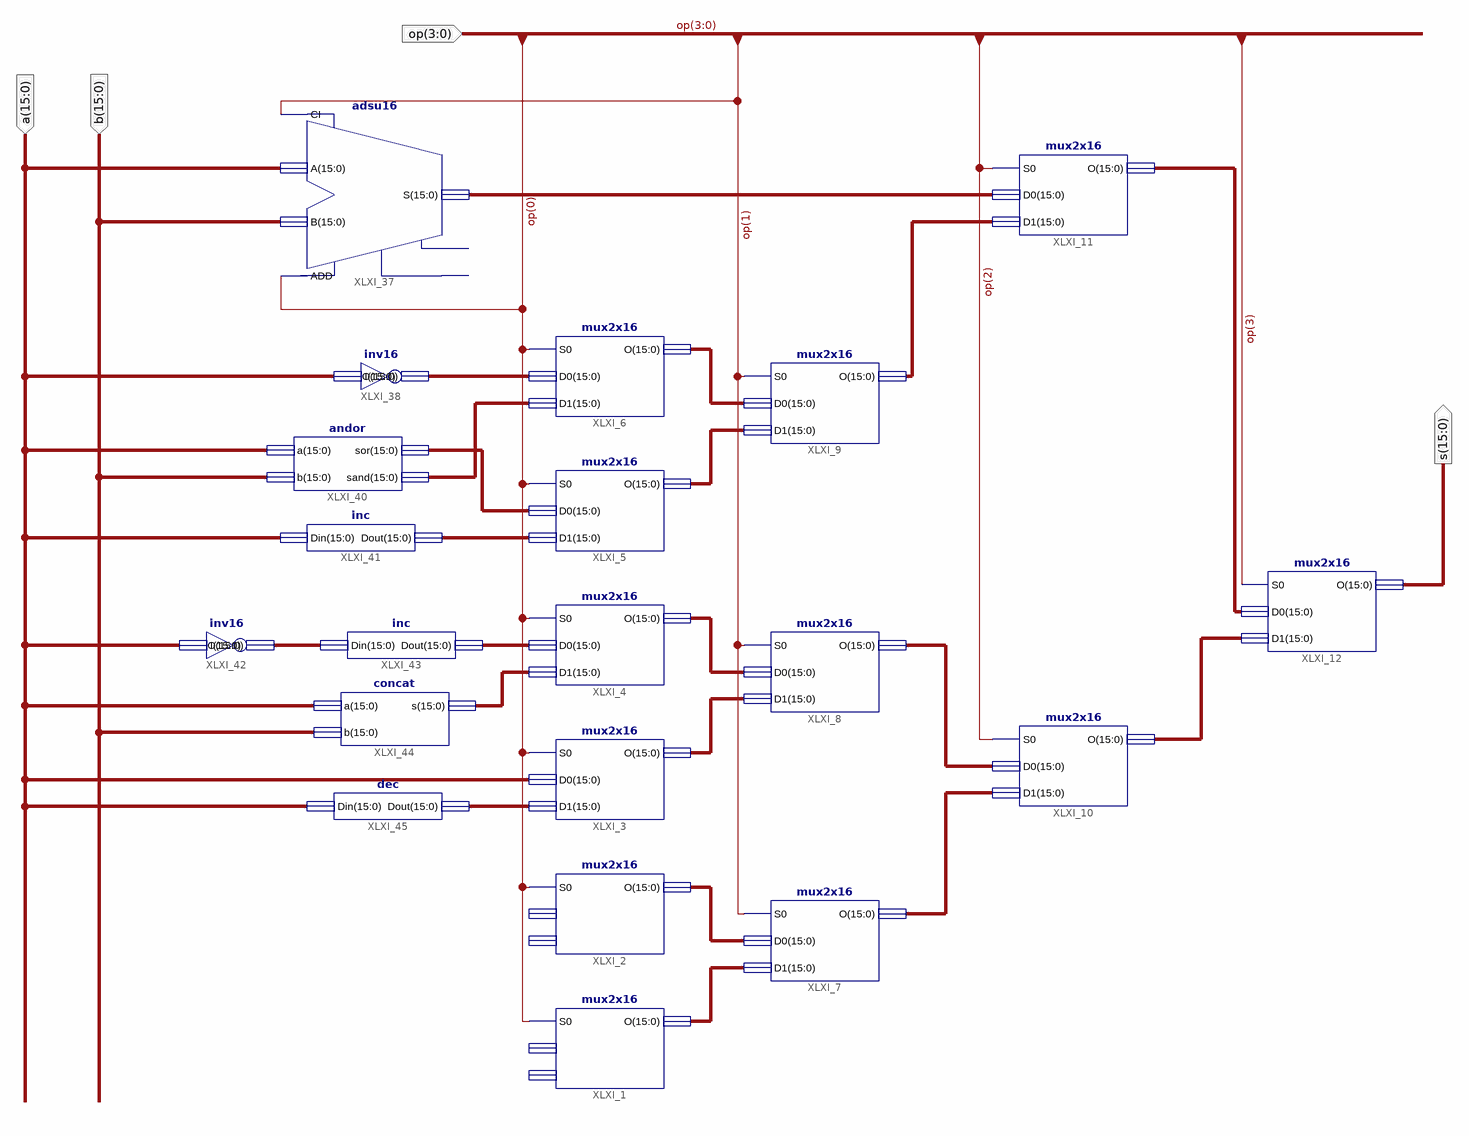
[diagram p0: schematic sheet 1]
// Xilinx ISE schematic ALU.sch (spartan3e) as structural Verilog: 20 symbols, 4 ports
module ALU (
  input  [15:0] a,
  input  [15:0] b,
  input  [3:0] op,
  output [15:0] s
);

  wire [15:0] XLXN_5, XLXN_6, XLXN_7, XLXN_8, XLXN_9, XLXN_10, XLXN_25, XLXN_26, XLXN_33, XLXN_36, XLXN_39,
       XLXN_109, XLXN_110, XLXN_111, XLXN_112, XLXN_113, XLXN_114, XLXN_115, XLXN_116, XLXN_117;

  mux2x16 XLXI_12 (.S0(op[3]), .D0(XLXN_39), .D1(XLXN_36), .O(s));
  mux2x16 XLXI_11 (.S0(op[2]), .D0(XLXN_109), .D1(XLXN_33), .O(XLXN_39));
  mux2x16 XLXI_10 (.S0(op[2]), .D0(XLXN_25), .D1(XLXN_26), .O(XLXN_36));
  mux2x16 XLXI_9 (.S0(op[1]), .D0(XLXN_5), .D1(XLXN_6), .O(XLXN_33));
  mux2x16 XLXI_8 (.S0(op[1]), .D0(XLXN_7), .D1(XLXN_8), .O(XLXN_25));
  mux2x16 XLXI_7 (.S0(op[1]), .D0(XLXN_9), .D1(XLXN_10), .O(XLXN_26));
  mux2x16 XLXI_6 (.S0(op[0]), .D0(XLXN_110), .D1(XLXN_111), .O(XLXN_5));
  mux2x16 XLXI_5 (.S0(op[0]), .D0(XLXN_112), .D1(XLXN_113), .O(XLXN_6));
  mux2x16 XLXI_4 (.S0(op[0]), .D0(XLXN_114), .D1(XLXN_116), .O(XLXN_7));
  mux2x16 XLXI_3 (.S0(op[0]), .D0(a), .D1(XLXN_117), .O(XLXN_8));
  mux2x16 XLXI_2 (.S0(op[0]), .O(XLXN_9));  // open: D0, D1
  mux2x16 XLXI_1 (.S0(op[0]), .O(XLXN_10));  // open: D0, D1
  adsu16 XLXI_37 (.A(a), .ADD(op[0]), .B(b), .CI(op[1]), .S(XLXN_109));  // open: CO, OFL
  inv16 XLXI_38 (.I(a), .O(XLXN_110));
  andor XLXI_40 (.a(a), .b(b), .sor(XLXN_112), .sand(XLXN_111));
  inc XLXI_41 (.Din(a), .Dout(XLXN_113));
  inv16 XLXI_42 (.I(a), .O(XLXN_115));
  inc XLXI_43 (.Din(XLXN_115), .Dout(XLXN_114));
  concat XLXI_44 (.a(a), .b(b), .s(XLXN_116));
  dec XLXI_45 (.Din(a), .Dout(XLXN_117));
endmodule
